# Altium schematic sheet Dual_USB-A.SchDoc: Dual USB A
size A4; DrawnBy: Fabian Hochberg; Organization: KIT; Address1: Elektrotechnisches Institut; Address2: Engelbert-Arnold-Str. 5; Address3: 76131 Karlsruhe; DocumentNumber: 2; Revision: 1.0; SheetNumber: 2; SheetTotal: 2
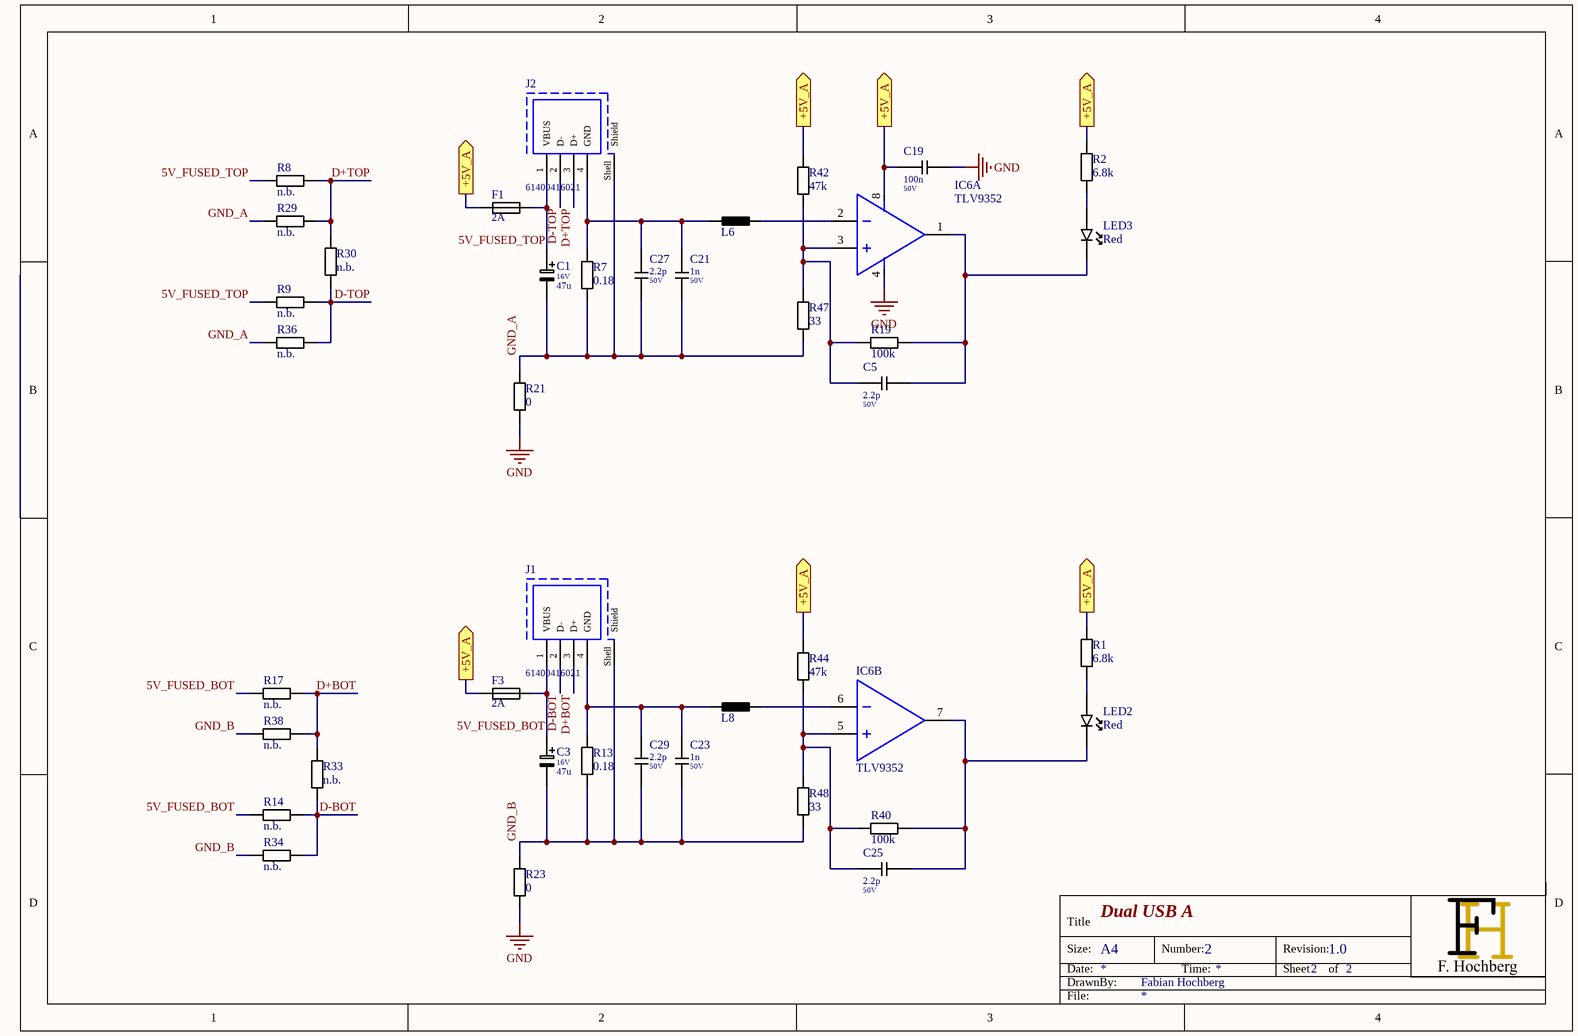
[diagram p0: Dual_USB-A.SchDoc]

## Parts
C1  value 47u  Voltage: 16V  [CAPAE_5x5.4]  (hidden comment: 47u_16V)
C3  value 47u  Voltage: 16V  [CAPAE_5x5.4]  (hidden comment: 47u_16V)
C5  value 2.2p  Voltage: 50V  [0603_C]  (hidden comment: 2.2p_50V)
C19  value 100n  Voltage: 50V  [0603_C]  (hidden comment: 100n_50V)
C21  value 1n  Voltage: 50V  [0603_C]  (hidden comment: 1n_50V)
C23  value 1n  Voltage: 50V  [0603_C]  (hidden comment: 1n_50V)
C25  value 2.2p  Voltage: 50V  [0603_C]  (hidden comment: 2.2p_50V)
C27  value 2.2p  Voltage: 50V  [0603_C]  (hidden comment: 2.2p_50V)
C29  value 2.2p  Voltage: 50V  [0603_C]  (hidden comment: 2.2p_50V)
F1  2A  [0603_Fuse]
F3  2A  [0603_Fuse]
IC6  TLV9352  [SOT23-8]  (parts A,B of 2)
J1  61400416021  [61400416021]
J2  61400416021  [61400416021]
L6  100 Ohm @ 100MHz  [0603_L]  (value not drawn)
L8  100 Ohm @ 100MHz  [0603_L]  (value not drawn)
LED2  Red  [0603_LED]
LED3  Red  [0603_LED]
R1  6.8k  [0603_R]
R2  6.8k  [0603_R]
R7  0.18  [2512_R]
R8  n.b.  [0603_R]
R9  n.b.  [0603_R]
R13  0.18  [2512_R]
R14  n.b.  [0603_R]
R17  n.b.  [0603_R]
R19  100k  [0603_R]
R21  0  [0603_R]
R23  0  [0603_R]
R29  n.b.  [0603_R]
R30  n.b.  [0603_R]
R33  n.b.  [0603_R]
R34  n.b.  [0603_R]
R36  n.b.  [0603_R]
R38  n.b.  [0603_R]
R40  100k  [0603_R]
R42  47k  [0603_R]
R44  47k  [0603_R]
R47  33  [0603_R]
R48  33  [0603_R]

## Ports
+5V_A (out)

## Nets
GND: C19.1 IC6.4(GND) R21.2 R23.2
5V_FUSED_BOT: C3.1 F3.1 J1.1(VBUS) R14.2 R17.2
5V_FUSED_TOP: C1.1 F1.1 J2.1(VBUS) R8.2 R9.2
+5V_A: C19.2 F1.2 F3.2 IC6.8(V15) R1.2 R2.2 R42.2 R44.2 ; port +5V_A
D+BOT: J1.3(D+) R17.1 R33.1 R38.1
D+TOP: J2.3(D+) R8.1 R29.1 R30.1
D-BOT: J1.2(D-) R14.1 R33.2 R34.1
D-TOP: J2.2(D-) R9.1 R30.2 R36.1
GND_A: C1.2 C21.2 C27.2 J2.Shell(Shield) R7.1 R21.1 R29.2 R36.2 R47.1
GND_B: C3.2 C23.2 C29.2 J1.Shell(Shield) R13.1 R23.1 R34.2 R38.2 R48.1
NetC5_1: C5.1 IC6.1 LED3.1(K) R19.2
NetC5_2: C5.2 IC6.3 R19.1 R42.1 R47.2
NetC21_1: C21.1 C27.1 J2.4(GND) L6.1 R7.2
NetC23_1: C23.1 C29.1 J1.4(GND) L8.1 R13.2
NetC25_1: C25.1 IC6.7 LED2.1(K) R40.2
NetC25_2: C25.2 IC6.5 R40.1 R44.1 R48.2
NetIC6_2: IC6.2 L6.2
NetIC6_6: IC6.6 L8.2
NetLED2_2: LED2.2(A) R1.1
NetLED3_2: LED3.2(A) R2.1

## Notes on the sheet
- Title
- Size:
- Date:
- DrawnBy:
- A4
- Number:
- Time:
- Revision:
- Sheet
- of
- File:

## Library data of the parts
C1 C3 = C POL: Elko
C5 C19 C21 C23 C25 C27 C29 = C: Keramikkondensator
F1 F3 = Fuse: Value: 2A
IC6 = Dual OP Amp: OP / Comparator
J1 J2 = CMP-1502-03227-1: USB 2.0 Type A Receptacle WR-COM, Horizontal, THT; Manufacturer: Wurth Elektronik; Working Voltage: 30VAC; Rated Current: 1.5A; Contact Resistance: 20mOhm; OutsideAllowed: Yes; Manufacturer URL: http://www.we-online.de; Publisher: WurthElektronik; Packaging: Tray; Operating Temperature: -40to105degC; Orientation: Horizontal; Mounting Technology: THT; Part Number: 61400416021; Gender: Receptacle; Package Reference: 61400416021; Connector Type: USB2.0TypeA; Datasheet URL: https://katalog.we-online.de/em/datasheet/61400416021.pdf
L6 L8 = L: 0,15 Ohm 1A max / 100 Ohm @ 100MHz; EBS_Nummer: 10111; HelpURL: https://ebs.eti.kit.edu/Artikel/Detailansicht/10111
LED2 LED3 = LED: Color: Red
R1 R2 R7-R9 R13 R14 R17 R19 R21 R23 R29 R30 R33 R34 R36 R38 R40 R42 R44 R47 R48 = R
  R1 R2: Value: 6.8k
  R7 R13: Value: 0.18
  R8 R9 R14 R17 R29 R30 R33 R34 R36 R38: Value: n.b.
  R19 R40: Value: 100k
  R21 R23: Value: 0
  R42 R44: Value: 47k
  R47 R48: Value: 33